# EAGLE design LPC_2TE_3.4Hqp (EAGLE 5.00)
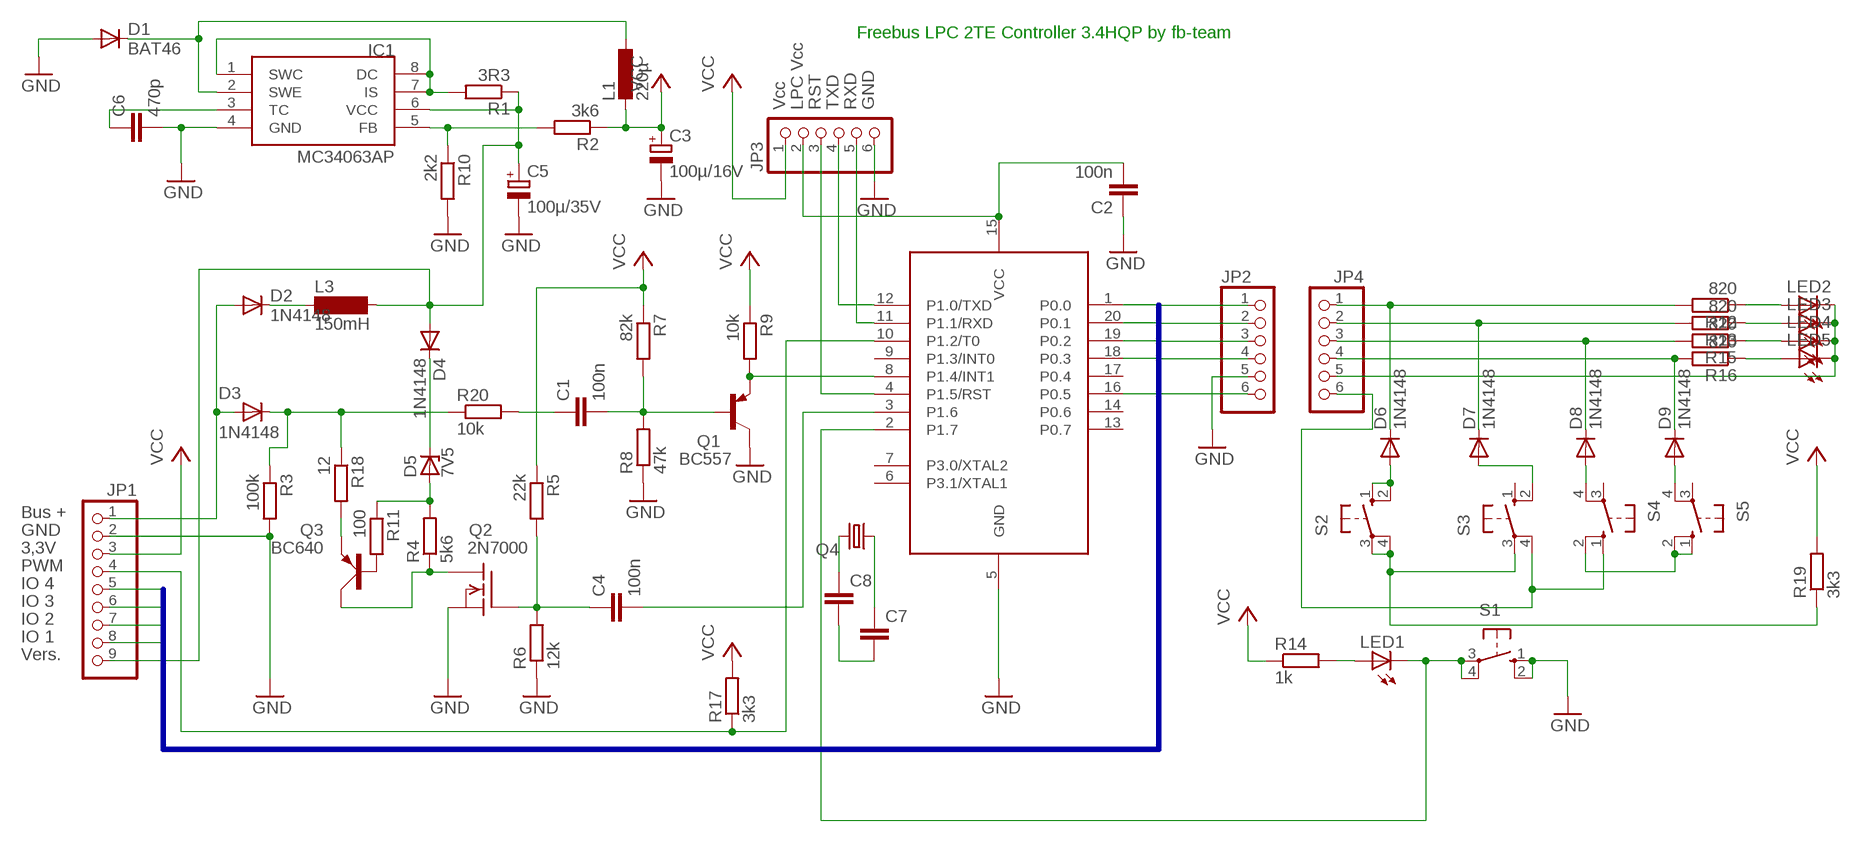
[diagram p0: schematic, sheet 1]

## Parts
C1  100n  C-EU050-024X044  [C050-024X044]
C2  100n  C-EU050-024X044  [C050-024X044]
C3  100µ/16V  CPOL-EUE3.5-8  [E3,5-8]
C4  100n  C-EU050-024X044  [C050-024X044]
C5  100µ/35V  CPOL-EUE3.5-8  [E3,5-8]
C6  470p  C-EU025-024X044  [C025-024X044]
C7  C-EU050-024X044  [C050-024X044]
C8  C-EU050-024X044  [C050-024X044]
D1  BAT46  BAT81  [DO34-7]
D2  1N4148  [DO35-10]
D3  1N4148  DO35-STEHEND  [DO35-S]
D4  1N4148  [DO35-10]
D5  7V5  ZPD  [DO35Z10]
D6  1N4148  [DO35-10]
D7  1N4148  [DO35-10]
D8  1N4148  [DO35-10]
D9  1N4148  [DO35-10]
IC1  MC34063AP  [DIL08]
JP1  PINHD-1X9  [1X09]
JP2  PINHD-1X6  [1X06]
JP3  PINHD-1X6  [1X06]
JP4  PINHD-1X6  [1X06]
L1  220µ  L-EU0207/2V  [0207/2V]
L3  150mH  BS11  [BS11]
LED1  LED3MM  [LED3MM]
LED2  LED3MM  [LED3MM]
LED3  LED3MM  [LED3MM]
LED4  LED3MM  [LED3MM]
LED5  LED3MM  [LED3MM]
Q1  BC557  [TO92]
Q2  2N7000  VN2222KM  [TO237]
Q3  BC640  [SOT54D]
Q4  CRYSTALHC49S  [HC49/S]
R1  3R3  R-EU_0207/2V  [0207/2V]
R2  3k6  R-EU_0207/2V  [0207/2V]
R3  100k  R-EU_0207/2V  [0207/2V]
R4  5k6  R-EU_0207/2V  [0207/2V]
R5  22k  R-EU_0207/2V  [0207/2V]
R6  12k  R-EU_0207/2V  [0207/2V]
R7  82k  R-EU_0207/2V  [0207/2V]
R8  47k  R-EU_0207/2V  [0207/2V]
R9  10k  R-EU_0207/2V  [0207/2V]
R10  2k2  R-EU_0207/2V  [0207/2V]
R11  100  R-EU_0207/2V  [0207/2V]
R12  820  R-EU_0207/10  [0207/10]
R13  820  R-EU_0207/10  [0207/10]
R14  1k  R-EU_0207/2V  [0207/2V]
R15  820  R-EU_0207/10  [0207/10]
R16  820  R-EU_0207/10  [0207/10]
R17  3k3  R-EU_0207/2V  [0207/2V]
R18  12  R-EU_0207/2V  [0207/2V]
R19  3k3  R-EU_0207/10  [0207/10]
R20  10k  R-EU_0207/2V  [0207/2V]
S1  10-XX  [B3F-10XX]
S2  10-XX  [B3F-10XX]
S3  10-XX  [B3F-10XX]
S4  10-XX  [B3F-10XX]
S5  10-XX  [B3F-10XX]
U1  89LPC922  [DIL20]

## Nets
EIB+: D2.A D3.P$1(A) JP1.1
GND: C2.1 C3.- C5.- C6.2 D1.A IC1.4(GND) JP1.2 JP2.5 JP3.6 Q1.3(C) Q2.3(S) R3.2 R6.1 R8.1 R10.2 S1.1(S) S1.2(S1) U1.5(GND)
N$1: Q1.1(E) R9.2 U1.8(P1.4/INT1)
N$2: C1.2 Q1.2(B) R7.2 R8.2
N$3: D8.A S4.4(P1)
N$4: D3.P$2(B) R3.1 R18.1 R20.1
N$5: C4.2 U1.3(P1.6)
N$6: D9.A S5.4(P1)
N$7: LED1.K(C) S1.3(P) S1.4(P1) U1.2(P1.7)
N$8: IC1.1(SWC) IC1.7(IS) IC1.8(DC) R1.2
N$9: LED1.A R14.2
N$10: C5.+ D4.A IC1.6(VCC) JP1.9 L3.2 R1.1
N$11: IC1.5(FB) R2.2 R10.1
N$12: D1.C IC1.2(SWE) L1.1
N$13: D2.C L3.1
N$14: C6.1 IC1.3(TC)
N$15: D4.C D5.C
N$16: D6.C JP4.1 R12.2
N$17: D7.C JP4.2 R13.2
N$18: D8.C JP4.3 R15.2
N$19: D9.C JP4.4 R16.2
N$20: LED2.A R12.1
N$21: LED3.A R13.1
N$22: LED4.A R15.1
N$23: LED5.A R16.1
N$24: JP4.5 LED2.K(C) LED3.K(C) LED4.K(C) LED5.K(C)
N$25: D5.A R4.2 R11.1
N$26: Q2.1(D) Q3.C R4.1
N$27: S4.2(S1) S5.1(S) S5.2(S1)
N$28: Q3.B R11.2
N$29: JP3.4 U1.12(P1.0/TXD)
N$30: JP3.5 U1.11(P1.1/RXD)
N$31: JP3.3 U1.4(P1.5/RST)
N$32: C2.2 JP3.2 U1.15(VCC)
N$33: Q3.E R18.2
N$34: C4.1 Q2.2(G) R5.2 R6.2
N$35: R19.1 S2.3(P) S2.4(P1) S3.3(P)
N$36: D6.A S2.1(S) S2.2(S1)
N$37: D7.A S3.2(S1)
N$40: JP4.6 S3.4(P1) S4.1(S)
N$41: C1.1 R20.2
N$42: JP2.6 U1.16(P0.5)
P0.0: JP1.8 JP2.1 U1.1(P0.0)
P0.1: JP1.7 JP2.2 U1.20(P0.1)
P0.2: JP1.6 JP2.3 U1.19(P0.2)
P0.3: JP1.5 JP2.4 U1.18(P0.3)
PWM: JP1.4 R17.1 U1.10(P1.2/T0)
VCC: C3.+ JP1.3 JP3.1 L1.2 R2.1 R5.1 R7.1 R9.1 R14.1 R17.2 R19.2
XTAL1: C7.1 Q4.1
XTAL2: C8.1 Q4.2
XTALGND: C7.2 C8.2
Unconnected: S3.1(S) S4.3(P) S5.3(P) U1.6(P3.1/XTAL1) U1.7(P3.0/XTAL2) U1.9(P1.3/INT0) U1.13(P0.7) U1.14(P0.6) U1.17(P0.4)

## Buses
P0.[0..3]

## Notes on the sheet
- Freebus LPC 2TE Controller 3.4HQP by fb-team
- Vcc | LPC Vcc | RST | TXD | RXD | GND
- Bus +
- GND
- 3,3V
- PWM
- IO 4
- IO 3
- IO 2
- IO 1
- Vers.

## Library data of the parts
C1 C2 C4 C6-C8 = rcl:C-EU: CAPACITOR, European symbol
C3 C5 = rcl:CPOL-EU: POLARIZED CAPACITOR, European symbol
D1 = diode:BAT81: DIODE barrier diode
D2 D4 D6-D9 = diode:1N4148: DIODE high speed (Philips)
D3 = kubi:DO35-STEHEND
D5 = diode:ZPD: Z DIODE 500 mW
IC1 = mc34063:MC34063
JP1 = pinhead:PINHD-1X9: PIN HEADER
JP2-JP4 = pinhead:PINHD-1X6: PIN HEADER
L1 = rcl:L-EU: INDUCTOR, European symbol
L3 = inductor-neosid:BS: INDUCTOR nominal inductance, magnetically screened
LED1-LED5 = led:LED: LED OSRAM: - CHIPLED LG R971, LG N971, LY N971, LG Q971, LY Q971, LO R971, LY R971 LH N974, LH R974 LS Q976, LO Q976, LY Q976 LO Q996 - Hyper CHIPLED LW Q18S LB Q993, LB Q99A, LB R99A - SideLED LS A670, LO A670, LY A670, LG A670, LP A670 LB A673, LV A673, LT A673, LW A673 LH A674 LY A675 LS A676, LA A676, LO A676, LY A676, LW A676 LS A679, LY A679, LG A679 - Hyper Micro SIDELED® LS Y876, LA Y876, LO Y876, LY Y876 LT Y87S - SmartLED LW L88C, LW L88S LB L89C, LB L89S, LG L890 LS L89K, LO L89K, LY L89K LS L896, LA L896, LO L896, LY L896 - TOPLED LS T670, LO T670, LY T670, LG T670, LP T670 LSG T670, LSP T670, LSY T670, LOP T670, LYG T670 LG T671, LOG T671, LSG T671 LB T673, LV T673, LT T673, LW T673 LH T674 LS T676, LA T676, LO T676, LY T676, LB T676, LH T676, LSB T676, LW T676 LB T67C, LV T67C, LT T67C, LS T67K, LO T67K, LY T67K, LW E67C LS E67B, LA E67B, LO E67B, LY E67B, LB E67C, LV E67C, LT E67C LW T67C LS T679, LY T679, LG T679 LS T770, LO T770, LY T770, LG T770, LP T770 LB T773, LV T773, LT T773, LW T773 LH T774 LS E675, LA E675, LY E675, LS T675 LS T776, LA T776, LO T776, LY T776, LB T776 LHGB T686 LT T68C, LB T68C - Hyper Mini TOPLED® LB M676 - Mini TOPLED Santana® LG M470 LS M47K, LO M47K, LY M47K Source: http://www.osram.convergy.de - LUMILED® LXK2-PW12-R00, LXK2-PW12-S00, LXK2-PW14-U00, LXK2-PW14-V00 LXK2-PM12-R00, LXK2-PM12-S00, LXK2-PM14-U00 LXK2-PE12-Q00, LXK2-PE12-R00, LXK2-PE12-S00, LXK2-PE14-T00, LXK2-PE14-U00 LXK2-PB12-K00, LXK2-PB12-L00, LXK2-PB12-M00, LXK2-PB14-N00, LXK2-PB14-P00, LXK2-PB14-Q00 LXK2-PR12-L00, LXK2-PR12-M00, LXK2-PR14-Q00, LXK2-PR14-R00 LXK2-PD12-Q00, LXK2-PD12-R00, LXK2-PD12-S00 LXK2-PH12-R00, LXK2-PH12-S00 LXK2-PL12-P00, LXK2-PL12-Q00, LXK2-PL12-R00 Source: www.luxeon.com
Q1 = transistor-pnp:BC557: PNP Transistor
Q2 = transistor-fet:VN2222KM: N-Channel Enhancement MOSFET (VMOS); 60V; 0,5A; 7,5Ohm
Q3 = transistor-small-signal:BC640: PNP TRANSISTOR
Q4 = crystal:CRYSTAL: CRYSTAL
R1-R20 = rcl:R-EU_: RESISTOR, European symbol
S1-S5 = switch-omron:10-XX: OMRON SWITCH
U1 = micro-philips:89LPC922

## Board
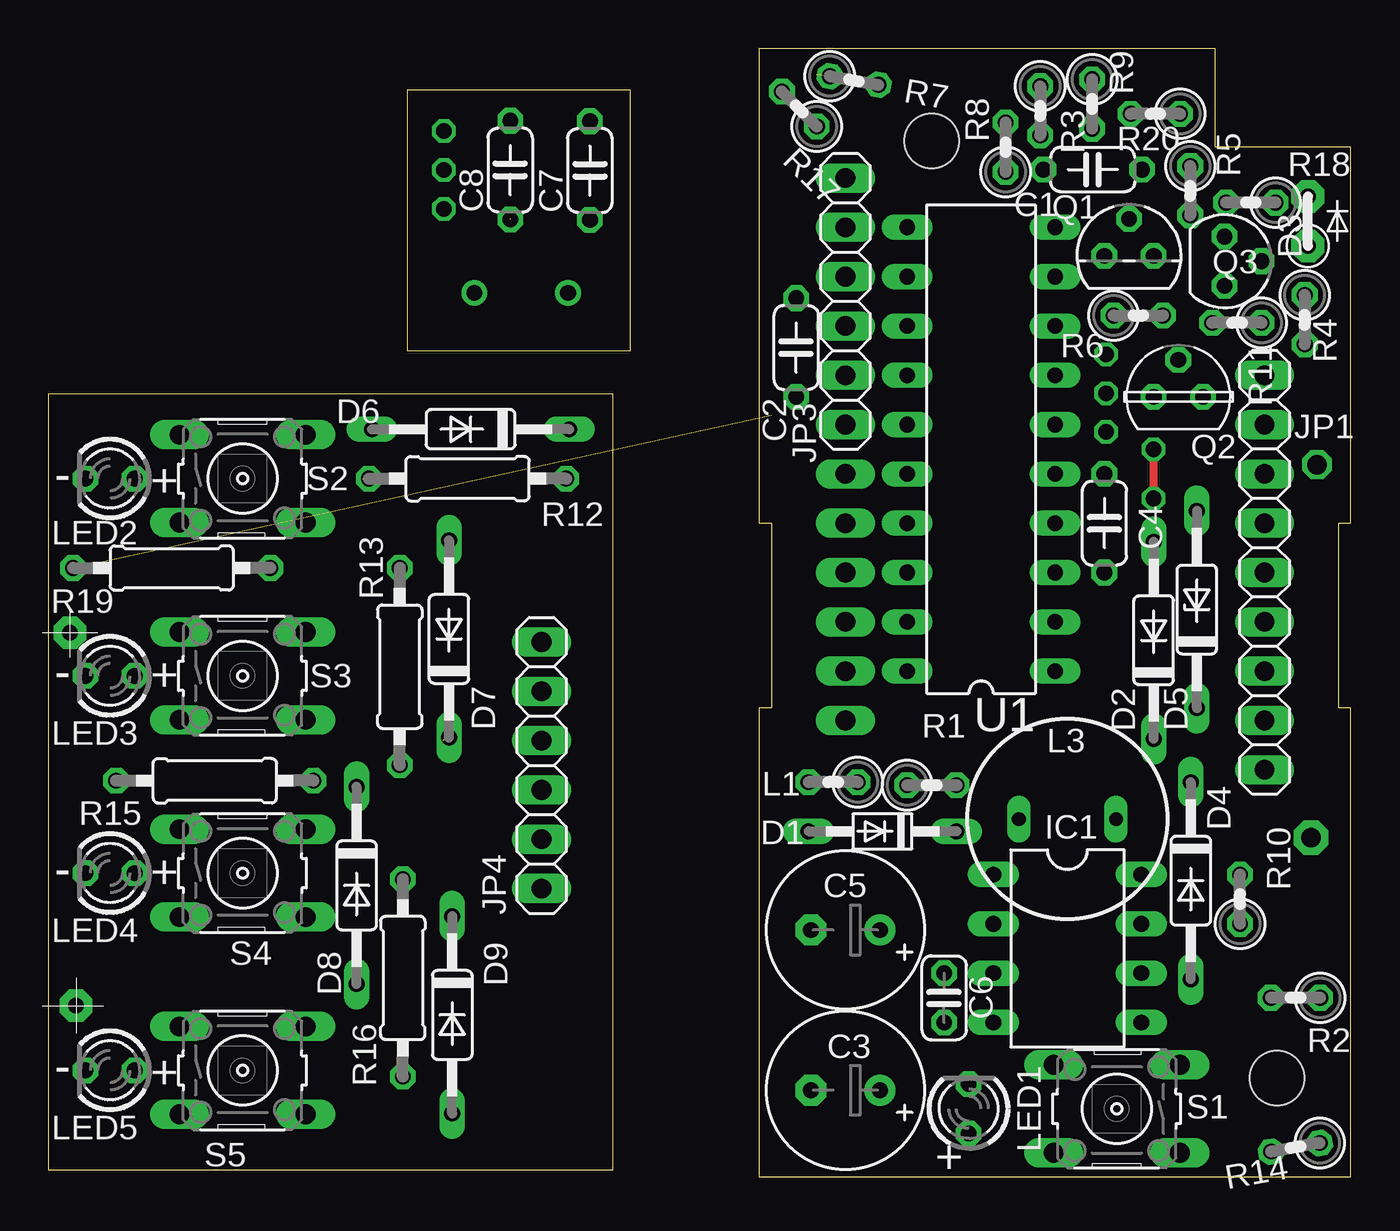
[diagram p1: board, top side]
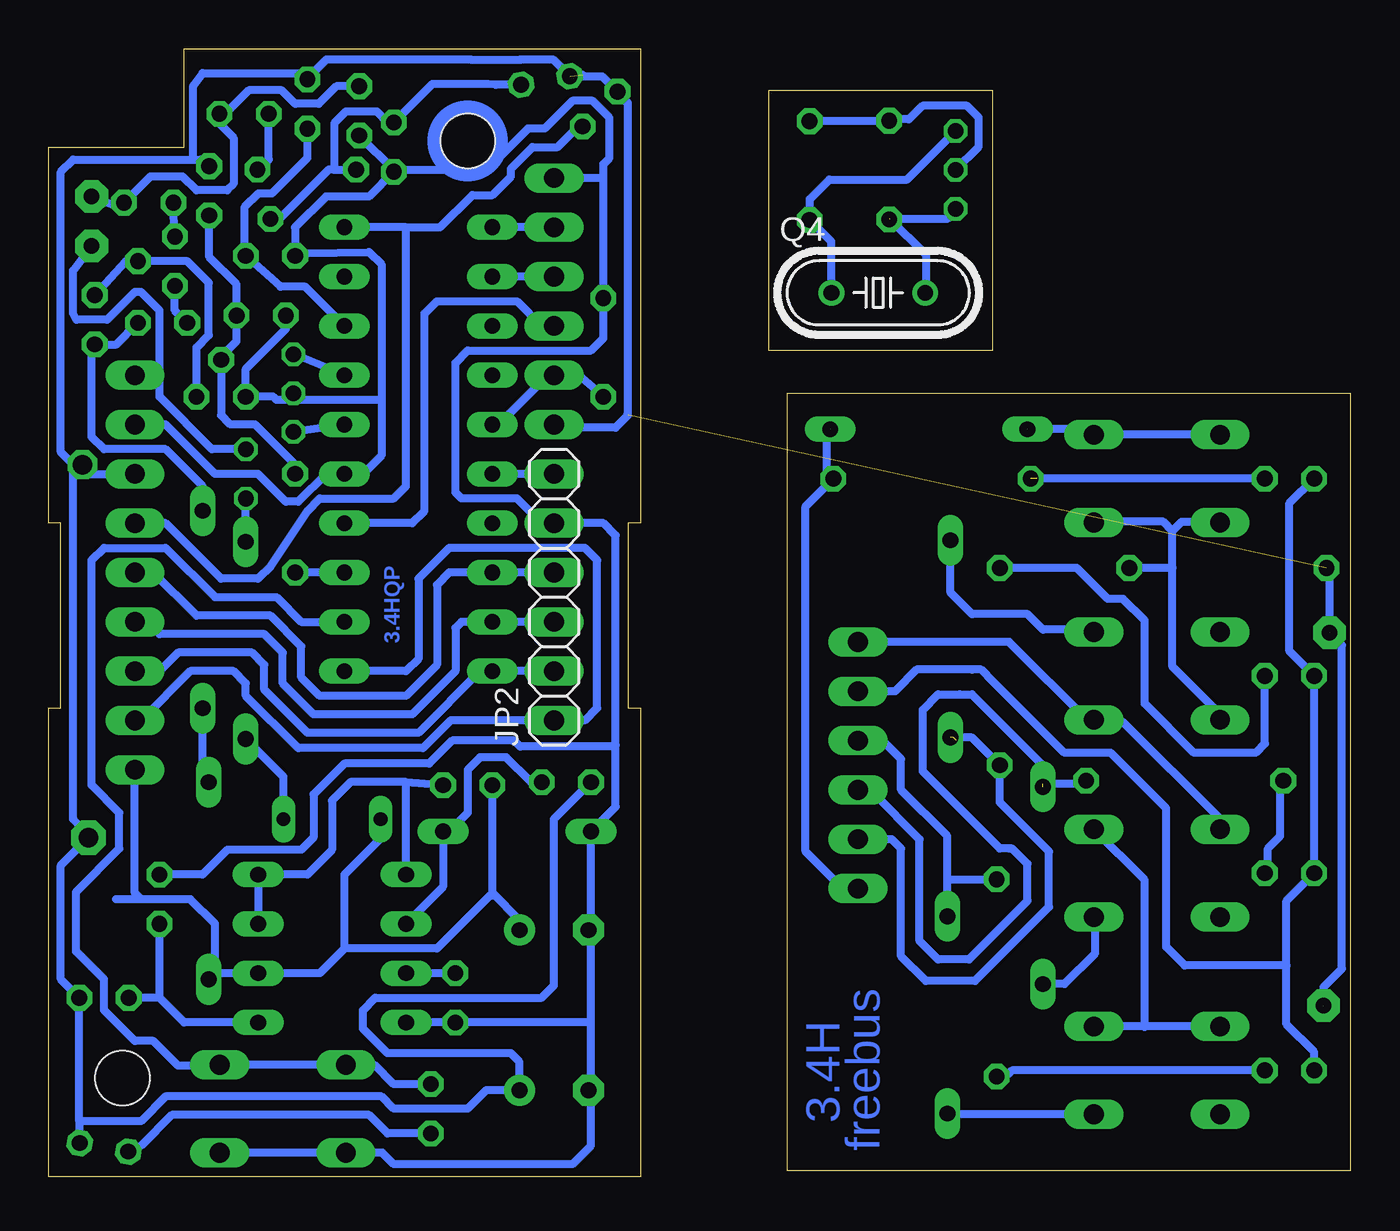
[diagram p2: board, bottom side, seen from below]

Size 67.08 x 58.1 mm. Coordinates in mm from the lower left corner, seen from the top.
Outline: 0,40.33 29.05,40.33
Outline: 29.05,40.33 29.05,0.33
Outline: 29.05,0.33 0,0.33
Outline: 0,0.33 0,40.33
Outline: 36.6,0 67.08,0 67.08,24.13 66.44,24.13 66.44,33.66 67.08,33.66 67.08,53.02 60.09,53.02 60.09,58.1 36.6,58.1 36.6,33.66 37.23,33.66 37.23,24.13 36.6,24.13 36.6,0
Outline: 18.47,42.55 29.97,42.55 29.97,55.95 18.47,55.95 18.47,42.55
Copper layers (1*16): Top 0.035mm / dielectric 1.5mm / Bottom 0.035mm
Design rules "default *": minimum track width 10mil, minimum drill 24mil, track to track 12mil, track to pad 12mil, pad to pad 12mil, via to via 12mil, smd to smd 8mil, copper to edge 12mil, drill to drill 8mil, minimum pad ring 10mil, minimum via ring 8mil, stop-mask expansion 4mil, vias tented up to drill 0mil, thermal gap 10mil
Holes 2.8 mm at 63.27,5.08 45.49,53.34
bRestrict: area 42.5,50.3 to 48.5,56.4; area 60.3,2.1 to 66.3,8.2

### Footprints (pad centres in the part's own frame; a part is rotated, then mirrored left to right if it is on the bottom)
C050-024X044 = drill 0.813 octagon: 1 -2.54,0; 2 2.54,0
E3,5-8 = drill 0.813 pad 1.6 round: + -1.778,0 | drill 0.813 pad 1.6 octagon: - 1.778,0
C025-024X044 = drill 0.813 octagon: 1 -1.27,0; 2 1.27,0
DO34-7 = drill 0.813 long: A 3.81,0; C -3.81,0
DO35-10 = drill 0.813 long: A 5.08,0; C -5.08,0
DO35-S = drill 0.8 pad 1.676 octagon: P$1 -1.27,0; P$2 1.27,0
DO35Z10 = drill 0.813 long: A 5.08,0; C -5.08,0
DIL08 = drill 0.813 long: 1 -3.81,-3.81; 2 -1.27,-3.81; 3 1.27,-3.81; 4 3.81,-3.81; 5 3.81,3.81; 6 1.27,3.81; 7 -1.27,3.81; 8 -3.81,3.81
1X09 = drill 1.016 long: 1 -10.16,0; 2 -7.62,0; 3 -5.08,0; 4 -2.54,0; 5 0,0; 6 2.54,0; 7 5.08,0; 8 7.62,0; 9 10.16,0
1X06 = drill 1.016 long: 1 -6.35,0; 2 -3.81,0; 3 -1.27,0; 4 1.27,0; 5 3.81,0; 6 6.35,0
0207/2V = drill 0.813 octagon: 1 -1.27,0; 2 1.27,0
BS11 = drill 0.7 long: 1 -2.5,0; 2 2.5,0
LED3MM = drill 0.813 octagon: A -1.27,0; K 1.27,0
TO92 = drill 0.813 octagon: 1 1.27,0; 2 0,1.905; 3 -1.27,0
TO237 = drill 0.813 octagon: 1 1.27,0; 2 0,1.905; 3 -1.27,0
SOT54D = drill 0.813 octagon: B 1.27,0; C 0,1.905; E -1.27,0
HC49/S = drill 0.813 round: 1 -2.413,0; 2 2.413,0
0207/10 = drill 0.813 octagon: 1 -5.08,0; 2 5.08,0
B3F-10XX = drill 1.016 long: 1 -3.251,2.261; 2 3.251,2.261; 3 -3.251,-2.261; 4 3.251,-2.261
DIL20 = drill 0.813 long: 1 -11.43,-3.81; 2 -8.89,-3.81; 3 -6.35,-3.81; 4 -3.81,-3.81; 5 -1.27,-3.81; 6 1.27,-3.81; 7 3.81,-3.81; 8 6.35,-3.81; 9 8.89,-3.81; 10 11.43,-3.81; 11 11.43,3.81; 12 8.89,3.81; 13 6.35,3.81; 14 3.81,3.81; 15 1.27,3.81; 16 -1.27,3.81; 17 -3.81,3.81; 18 -6.35,3.81; 19 -8.89,3.81; 20 -11.43,3.81

### Placement (x,y rotation side)
C1  53.78,51.87 180 top
C2  38.51,42.7 270 top
C3  41.04,4.45 180 top
C4  54.38,33.66 270 top
C5  41.04,12.7 180 top
C6  46.12,9.21 270 top
C7  27.88,51.82 90 top
C8  23.78,51.84 90 top
D1  42.95,17.78 180 top
D2  56.92,27.62 90 top
D3  64.86,49.21 90 top
D4  58.82,15.24 270 top
D5  59.14,29.21 90 top
D6  21.74,38.49 180 top
D7  20.63,27.69 90 top
D8  15.87,15 270 top
D9  20.79,8.33 270 top
IC1  52.47,11.75 270 top
JP1  62.63,31.11 270 top
JP2  41.04,29.85 90 bottom
JP3  41.04,45.08 90 top
JP4  25.39,21.19 90 top
L1  40.41,20.32 180 top
L3  52.47,18.41 180 top
LED1  47.39,3.49 90 top
LED2  3.16,35.95 180 top
LED3  3.16,25.79 180 top
LED4  3.16,15.63 180 top
LED5  3.16,5.47 180 top
Q1  55.65,47.42 0 top
Q2  58.19,40.16 0 top
Q3  60.57,47.15 270 top
Q4  24.35,45.52 0 bottom
R1  45.49,20.16 0 top
R2  64.22,9.21 180 top
R3  51.08,54.89 270 top
R4  64.7,44.13 270 top
R5  58.81,50.77 270 top
R6  56.13,44.35 0 top
R7  41.49,56.46 350 top
R8  49.3,53.02 90 top
R9  53.74,55.24 270 top
R10  61.37,14.29 90 top
R11  61.21,43.97 180 top
R12  21.58,35.95 0 top
R13  18.09,26.27 270 top
R14  64.22,1.51 190 top
R15  8.56,20.39 0 top
R16  18.25,10.23 90 top
R17  38.67,54.99 135 top
R18  61.92,50.17 180 top
R19  6.34,31.35 180 top
R20  57.01,54.74 180 top
S1  55.02,3.49 180 top
S2  9.99,35.95 0 top
S3  9.99,25.79 0 top
S4  9.99,15.63 0 top
S5  9.99,5.47 0 top
U1  48.03,37.47 90 top

### Tracks (layer width: path | path; a pad name or v marks a point on that pad's centre or on a via)
EIB+  (via drill 0.8)
  Top 0.406: v56.92,37.47 v56.92,34.93
  Bottom 0.406: D2.A v56.92,34.93 | 61.36,41.28 JP1.1 | 61.36,41.28 61.36,44.61 62.32,45.56 62.64,45.56 64.06,44.13 65.65,44.13 65.81,44.45 65.81,46.67 D3.P$1 | v56.92,37.47 58.67,37.47 61.36,40.16 61.36,41.28
GND
  Bottom 0: 38.58,51.51 38.58,51.47 | 38.5,51.44 38.58,51.51 | 38.58,51.51
  Bottom 0.406: S1.1 51.88,1.23 51.84,1.27 51.76,1.19 S1.2 49.9,1.23 49.3,0.64 40.09,0.64 39.14,1.59 39.14,4.45 | 49.93,40.01 49.93,46.99 50.57,47.63 53.87,47.55 53.87,47.43 Q1.3 54.38,48.9 52.79,50.48 50.57,50.48 R8.1 | 49.93,40.01 49.93,37.15 50.89,36.2 U1.5 52.79,36.2 54.22,34.77 54.86,34.77 56.29,36.2 58.51,36.2 | C2.1 38.5,43.18 39.14,42.55 45.49,42.55 46.12,41.91 46.12,35.24 45.81,34.93 42.95,34.93 41.68,33.66 JP2.5 38.5,33.66 37.87,33.02 37.87,22.23 | C2.1 38.5,51.44 | 38.5,51.44 JP3.6 | IC1.4 C6.2 39.14,7.94 | 37.87,22.23 37.87,19.05 D1.A 39.14,12.7 | 39.14,12.7 C5.- | 39.14,4.45 C3.- | 39.14,7.94 39.14,12.7 | 39.14,4.45 39.14,7.94 | 58.51,36.2 61.05,38.74 JP1.2 | R10.2 59.14,15.56 57.87,16.83 54.06,16.83 53.43,17.46 53.43,19.69 51.84,21.27 47.47,21.27 46.28,22.46 43.19,22.46 43.11,22.46 42.79,22.15 37.95,22.15 37.87,22.23 | C2.1 38.66,45.24 C2.1 | 38.5,51.44 38.51,51.44 | R6.1 54.86,43.66 56.92,41.59 Q2.3 55.49,40.16 55.33,40.01 49.94,40.01 49.93,40.01 | 58.51,36.2 | R8.1 49.27,51.75 49.27,51.81 R3.2 | R8.1 | R8.1 48.87,51.75 | 38.58,51.47 38.51,51.55 38.51,52.15 38.19,52.47 38.19,54.53 39.06,55.4 40.09,55.4 41.52,53.98 42.39,53.98 44.06,52.31 44.3,51.99 44.54,51.83 49.3,51.83 R8.1
N$1
  Bottom 0.406: U1.8 53.86,45.84 55.13,45.84 Q1.1 56.94,47.43 56.97,47.45 56.97,49.95 56.27,50.65 55.57,50.65 53.74,52.47 R9.2
N$2
  Bottom 0.406: 51.27,51.85 51.27,51.87 C1.2 52.37,51.87 | Q1.2 55.19,49.33 52.65,51.87 52.37,51.87 | 52.37,51.87 52.37,51.85 | 52.37,51.87 52.37,54.25 51.77,54.85 50.17,54.85 49.61,54.29 R8.2 47.32,56.28 44.44,56.28 44.05,56.24 R7.2
N$3
  Bottom 0.406: D8.A 14.75,9.92 13.17,11.5 13.17,13.41 13.2,13.37 S4.4
N$4
  Bottom 0.406: D3.P$2 63.27,49.85 R18.1 | 62.97,50.25 62.95,50.24 R18.1 | R3.1 51.16,56.16 51.17,56.15 52.27,56.15 53.17,55.25 54.37,55.25 55.07,55.95 56.77,55.95 57.98,54.74 R20.1 58.28,54.22 57.56,53.5 57.56,51.12 57.87,50.8 59.46,50.8 60.17,51.51 61.84,51.51 R18.1 | R18.1
N$5
  Bottom 0.406: U1.3 | U1.3 C4.2 | U1.3
N$6
  Bottom 0.406: D9.A 20.63,3.25 20.59,3.21 S5.4
N$7
  Bottom 0.406: LED1.K 49.3,4.76 50.29,5.75 S1.4 51.76,5.96 51.84,6.03 52.12,5.75 S1.3 58.23,5.75 58.19,5.72 60.41,5.72 61.68,6.99 62.63,6.99 64.22,8.57 64.22,10.16 64.86,10.8 65.66,11.6 65.66,14.66 63.43,16.89 63.43,18.73 64.86,20.16 64.86,31.75 64.22,32.39 61.05,32.39 58.51,29.85 55.33,29.85 54.06,28.58 U1.2
N$8
  Bottom 0.406: IC1.7 IC1.8 53.74,15.56 52.47,16.83 52.47,19.37 51.52,20.32 48.66,20.32 | 48.66,20.32 R1.2 | IC1.1 48.66,20.32
N$9
  Bottom 0.406: LED1.A 49.62,2.22 50.57,3.18 60.73,3.18 62.32,1.59 R14.2
N$10
  Bottom 0.406: 51.84,11.75 53.11,10.48 IC1.6 58.51,10.48 | 51.84,11.75 47.08,11.75 44.35,14.48 44.22,14.48 44.22,14.61 | L3.2 49.97,17.42 51.84,15.56 51.84,11.75 | 58.51,10.48 D4.A | 44.22,14.61 R1.1 | C5.+ 42.82,13.21 44.22,14.61 | 58.51,10.48 58.51,13.02 59.78,14.29 62.16,14.29 | 62.16,14.29 62.32,14.29 62.63,14.61 JP1.9 | 62.16,14.29 | 62.16,14.29 63.6,14.29
N$11
  Bottom 0.406: IC1.5 60.09,7.94 61.36,9.21 | 61.36,9.21 R10.1 | 61.36,9.21 R2.2
N$12
  Bottom 0.406: IC1.2 46.76,14.92 D1.C 46.44,17.78 45.49,18.73 45.49,20.96 44.85,21.59 43.51,21.59 42.24,20.32 L1.1
N$13
  Bottom 0.406: L3.1 54.97,20.6 D2.C
N$14
  Bottom 0.406: C6.1 IC1.3
N$15
  Bottom 0.406: D4.C 59.14,20.96 D5.C
N$16  (1 unrouted)
  Bottom 0.406: D6.C 26.98,38.49 26.98,36.27 R12.2 28.09,34.52 28.09,16.74 26.34,15 25.39,15 JP4.1
N$17  (2 unrouted)
  Bottom 0.406: JP4.2 23.64,17.38 23.17,16.9 23.17,11.34 21.9,10.07 19.36,10.07 15.55,13.88 15.55,16.74 18.09,19.28 R13.2 19.52,22.62 20.47,22.62 | 20.31,22.46
N$18  (1 unrouted)
  Bottom 0.406: R15.2 14.12,20.23 15.86,20.23 | JP4.3 25.23,19.76 24.6,19.76 22.21,17.38 22.21,12.14 21.26,11.19 19.67,11.19 16.66,14.2 16.66,16.11 17.45,16.9 17.61,16.9 18.09,16.9 22.06,20.87 22.06,24.04 21.26,24.84 20.15,24.84 19.52,24.84 15.86,21.19 15.87,21.19 D8.C | D8.C
N$19
  Bottom 0.406: JP4.4 24.12,22.46 23.17,21.5 23.17,19.92 20.79,17.54 20.79,15.31 | R16.2 | 20.79,15.31 R16.2 | 20.79,15.31 | D9.C 20.79,15.31 | 20.79,15.31
N$20  (1 unrouted)
  Bottom 0.406: LED2.A 16.18,35.95
N$21
  Bottom 0.406: LED3.A | LED3.A 4.43,22.3 4.91,21.82 8.09,21.82 10.63,24.36 10.63,25.95 | 10.63,25.95 10.63,28.65 11.74,29.76 12.53,29.76 14.12,31.35 R13.1 | 10.63,25.95
N$22
  Bottom 0.406: R15.1 3.64,20.55 3.64,17.54 4.28,16.9 4.28,15.79 LED4.A
N$23
  Bottom 0.406: LED5.A 4.43,5.63 4.59,5.47 17.45,5.47 17.61,5.31 18.25,5.31 R16.1
N$24
  Bottom 0.406: LED2.K 3.16,34.68 3.16,27.06 LED3.K LED4.K 3.32,14.2 3.32,10.87 | 3.32,10.87 3.32,7.85 1.89,6.42 LED5.K | LED5.K | JP4.5 23.48,25 22.37,26.11 19.52,26.11 19.04,26.11 18.4,25.47 14.75,21.82 12.37,21.82 9.51,18.96 9.51,11.82 8.56,10.87 3.32,10.87
N$25
  Bottom 0.406: D5.A 59.14,35.56 61.05,37.47 64.22,37.47 64.86,38.1 64.86,42.86 | R11.1 63.59,42.86 R4.2 64.86,42.86 | 64.86,42.86
N$26
  Bottom 0.406: 64.86,45.4 R4.1 63.11,47.15 Q3.C 59.94,47.15 58.83,46.04 58.83,43.34 59.46,42.7 Q2.1
N$27
  Bottom 0.406: S5.1 10.63,7.73 | 10.63,7.73 S5.2 13.29,7.73 13.32,7.69 | S4.2 10.63,15.27 10.63,7.73 | 10.63,7.73 10.63,7.69
N$28
  Bottom 0.406: R11.2 60.09,44.13 60.57,44.61 Q3.B
N$29
  Bottom 0.406: JP3.4 U1.12
N$30
  Bottom 0.406: JP3.5 U1.11
N$31
  Bottom 0.406: U1.4 48.35,33.66 47.71,34.29 47.71,44.45 47.08,45.09 42.95,45.09 41.68,43.82 JP3.3
N$32
  Bottom 0.406: U1.15 43.9,38.74 41.36,41.28 JP3.2 39.78,41.28 C2.2
N$33
  Bottom 0.406: Q3.E R18.2
N$34
  Bottom 0.406: 58.19,42.23 | Q2.2 | C4.1 54.38,36.67 56.44,38.74 57.71,38.74 58.19,39.21 Q2.2 | R5.2 58.81,47.37 57.4,45.96 57.4,44.37 | 57.4,44.37 | 57.4,44.37 R6.2 57.4,43.02 58.19,42.23 | Q2.2 58.19,42.23 | Q2.2
N$35
  Bottom 0.406: S3.3 6.74,23.81 9.2,26.27 9.2,31.35 | 9.2,31.35 9.2,33.25 | 9.2,33.25 9.67,33.73 13.17,33.73 13.2,33.69 S2.4 | 9.2,33.25 | 9.2,33.25 8.72,33.73 6.82,33.73 6.78,33.69 S2.3 | R19.1 | 9.2,31.35 R19.1
N$36  (1 unrouted)
  Bottom 0.406: 13.48,38.17 13.45,38.21 S2.2 13.29,38.21 | 13.48,38.17 | S2.1 13.29,38.21 | 13.29,38.21 13.32,38.17 | 13.48,38.17 13.8,38.49 D6.A
N$37
  Bottom 0.406: S3.2 13.32,28.13 13.32,28.17 15.87,28.17 16.66,28.97 19.52,28.97 20.47,29.92 | 20.47,29.92 | D7.A 20.63,30.08 20.47,29.92
N$38  (via drill 0.8)
  Bottom 0.406: 51.84,41.28 v54.47,42.35
N$39  (via drill 0.8)
  Bottom 0.406: 51.84,38.74 v54.47,38.35
N$40
  Bottom 0.406: JP4.6 17.61,27.54 13.48,23.41 13.36,23.41 S3.4 13.24,23.49 13.32,23.41 11.74,23.41 | S4.1 6.74,18.41 11.74,23.41 | 11.74,23.41
N$41
  Bottom 0.406: C1.1 56.29,51.87 56.27,51.85 55.74,52.38 R20.2
N$42
  Bottom 0.406: U1.16 | U1.16 | JP2.6 U1.16
N$45  (via drill 0.8)
  other vias: 54.47,40.35
N$46
  Bottom 0.406: 54.37,40.35 54.37,40.05
N$49  (via drill 0.8)
  other vias: 20.37,49.85
P0.0
  Bottom 0.406: U1.1 48.66,26.04 48.03,26.67 48.03,30.8 46.44,32.39 39.46,32.39 38.82,31.75 38.82,24.13 39.46,23.5 JP2.1 46.36,23.5 47.79,22.07 54.22,22.07 56.92,24.77 56.92,25.4 57.55,26.04 59.78,26.04 62.32,23.5 JP1.8
P0.1
  Bottom 0.406: JP1.7 61.36,26.04 60.41,26.99 56.6,26.99 55.97,26.35 55.97,25.08 53.74,22.86 48.03,22.86 44.85,26.04 U1.20 JP2.2
P0.2
  Bottom 0.406: JP1.6 62,28.58 61.36,27.94 55.97,27.94 55.01,26.99 55.01,25.4 53.43,23.81 48.35,23.81 46.12,26.04 46.12,28.26 45.81,28.58 U1.19 JP2.3
P0.3
  Bottom 0.406: JP1.5 61.68,31.12 59.46,28.89 55.65,28.89 54.06,27.31 54.06,25.72 53.11,24.77 48.66,24.77 47.08,26.35 47.08,30.48 46.44,31.12 U1.18 JP2.4
PWM
  Bottom 0.406: 48.66,48.85 48.66,35.56 49.3,34.93 53.11,34.93 53.74,34.29 55.65,31.43 56.28,30.8 58.19,30.8 61.05,33.66 JP1.4 | 48.66,48.85 48.66,48.9 48.74,48.9 | 48.74,48.9 U1.10 | 48.66,48.85 48.67,48.85 | R17.1 39.57,54.17 39.73,54.15 40.86,53.02 42.16,53.02 43.27,51.91 43.27,51.51 44.22,50.56 45.25,50.56 46.92,48.9 48.74,48.9 | 48.74,48.9
VCC  (via drill 0.8 pad 1.68, 1, 1 pad 1.78)  (4 unrouted)
  Bottom 0.406: JP3.1 40.89,38.58 39.77,38.58 37.87,38.58 37.23,39.21 37.23,39.22 37.27,39.25 37.27,55.35 37.34,55.35 37.87,55.88 R17.2 38.56,56.67 R7.1 41.11,57.55 42.79,57.55 42.79,57.53 | 59.62,52.39 59.62,56.2 59.14,56.83 53.74,56.83 R9.1 53.74,56.57 52.77,57.55 49.87,57.55 | 59.62,52.39 65.81,52.39 66.44,51.75 66.44,37.31 65.65,36.51 | 65.49,2.86 R14.1 | 65.49,2.86 R2.1 66.44,10.16 66.44,16.03 v65.02,17.46 65.81,18.42 65.81,20 65.81,34.29 65.81,36.35 v65.33,36.67 | 65.49,2.86 62.32,2.86 61.05,4.13 49.93,4.13 49.3,3.49 45.49,3.49 44.54,4.45 C3.+ 42.82,5.91 43.27,6.35 49.62,6.35 50.89,7.62 50.89,8.57 50.25,9.21 41.68,9.21 41.04,9.84 41.04,18.42 L1.2 | v65.33,36.67 65.65,36.35 | JP1.3 65.49,36.2 65.65,36.35 | v65.33,36.67 65.65,36.35 | 65.65,36.35 65.81,36.51 | 65.65,36.51 | v65.33,36.67 65.65,36.51 | R19.2 1.1,31.03 1.1,29.92 v1.1,28.01 0.47,27.38 0.47,10.71 | 0.47,10.71 1.42,9.76 v1.42,8.8 | 0.47,10.71 | 49.87,57.55 49.77,57.55 | 39.56,56.75 39.57,56.75 | 42.79,57.53 45.33,57.53 45.47,57.55 49.87,57.55 | 42.79,57.53 42.72,57.53 | 59.62,52.39 59.22,52.39 58.88,52.04 R5.1
XTAL1  (via drill 0.8)
  Bottom 0.406: v20.37,53.85 22.87,51.35 26.87,51.35 27.87,50.35 27.87,49.3 C7.1 26.77,48.17 Q4.1
XTAL2  (1 unrouted)
  Bottom 0.406: 20.27,49.85 20.77,49.35 23.77,49.35 21.87,47.45 21.87,45.55 21.9,45.55 Q4.2
XTALGND  (via drill 0.8)
  Bottom 0.406: v20.37,51.85 19.17,53.05 19.17,54.55 19.77,55.15 22.07,55.15 22.77,54.45 23.77,54.45 23.77,54.4 C8.2 23.81,54.35 C7.2
(copper drawn outside any net)
  shapes: Bottom circle x1

### Text on the board
Bottom: 3.4HQP | 3.4H | freebus
tPlace: - | + | - | + | - | + | - | + | +